# Altium project Baitap28.PrjPcb
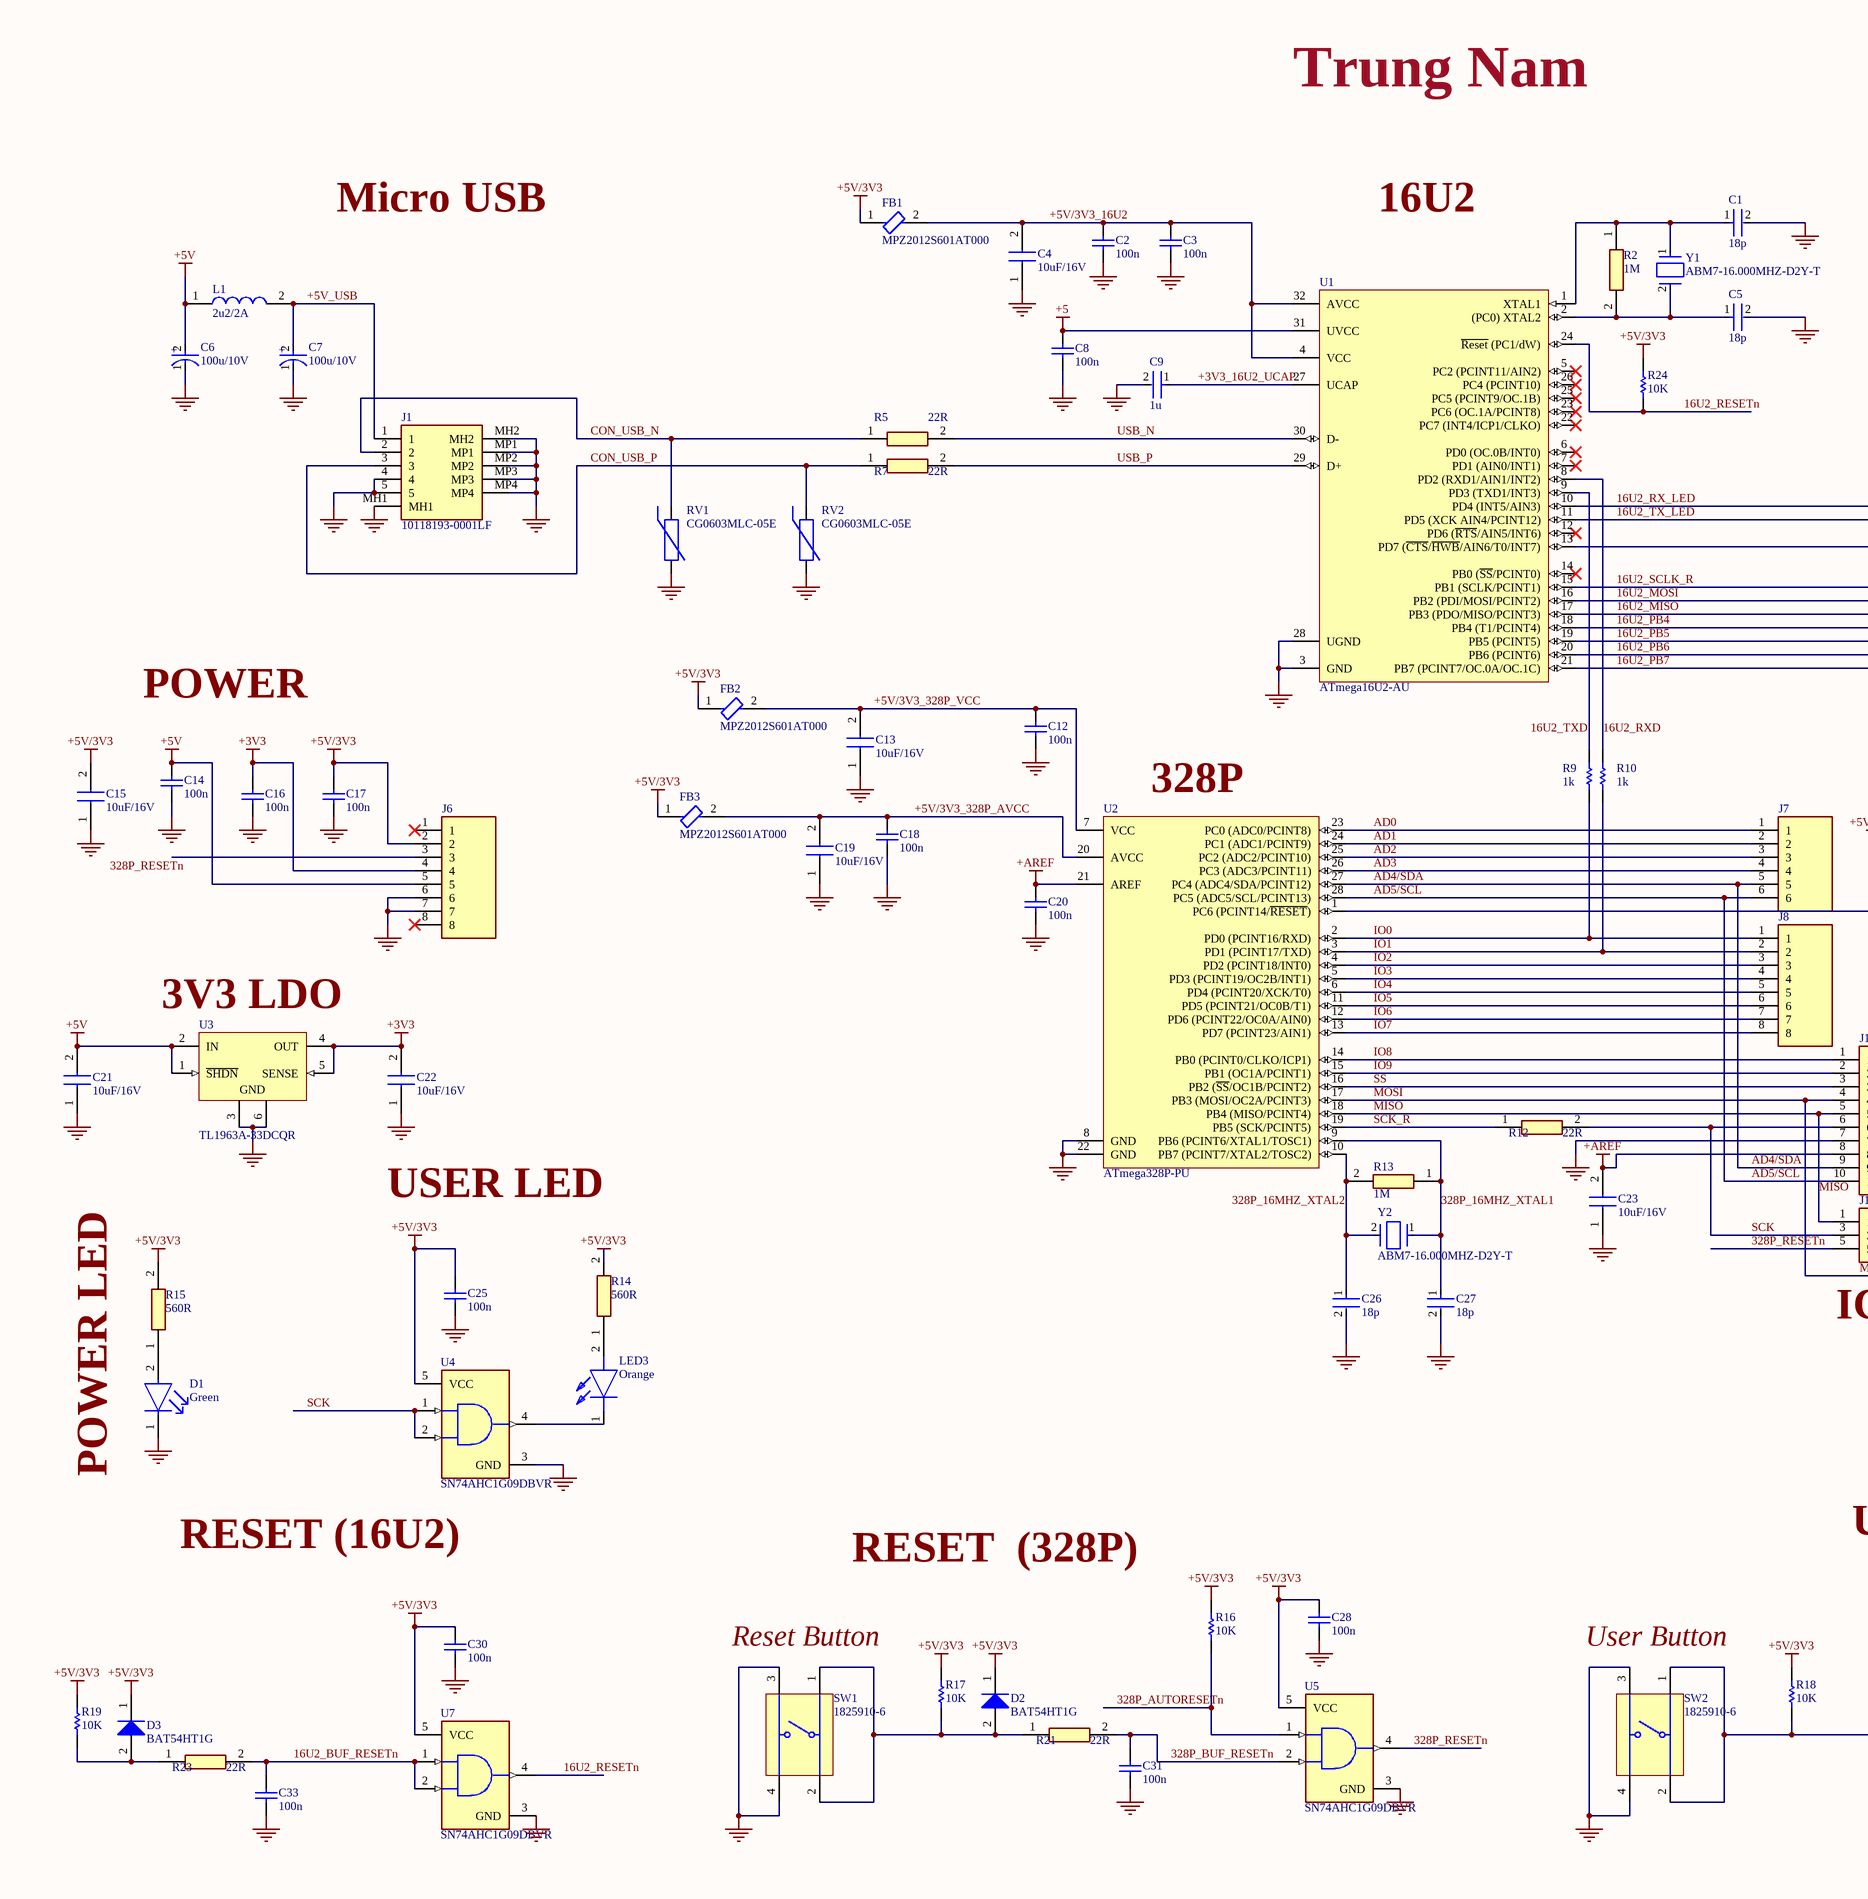
[diagram p0: schematic.SchDoc, left]
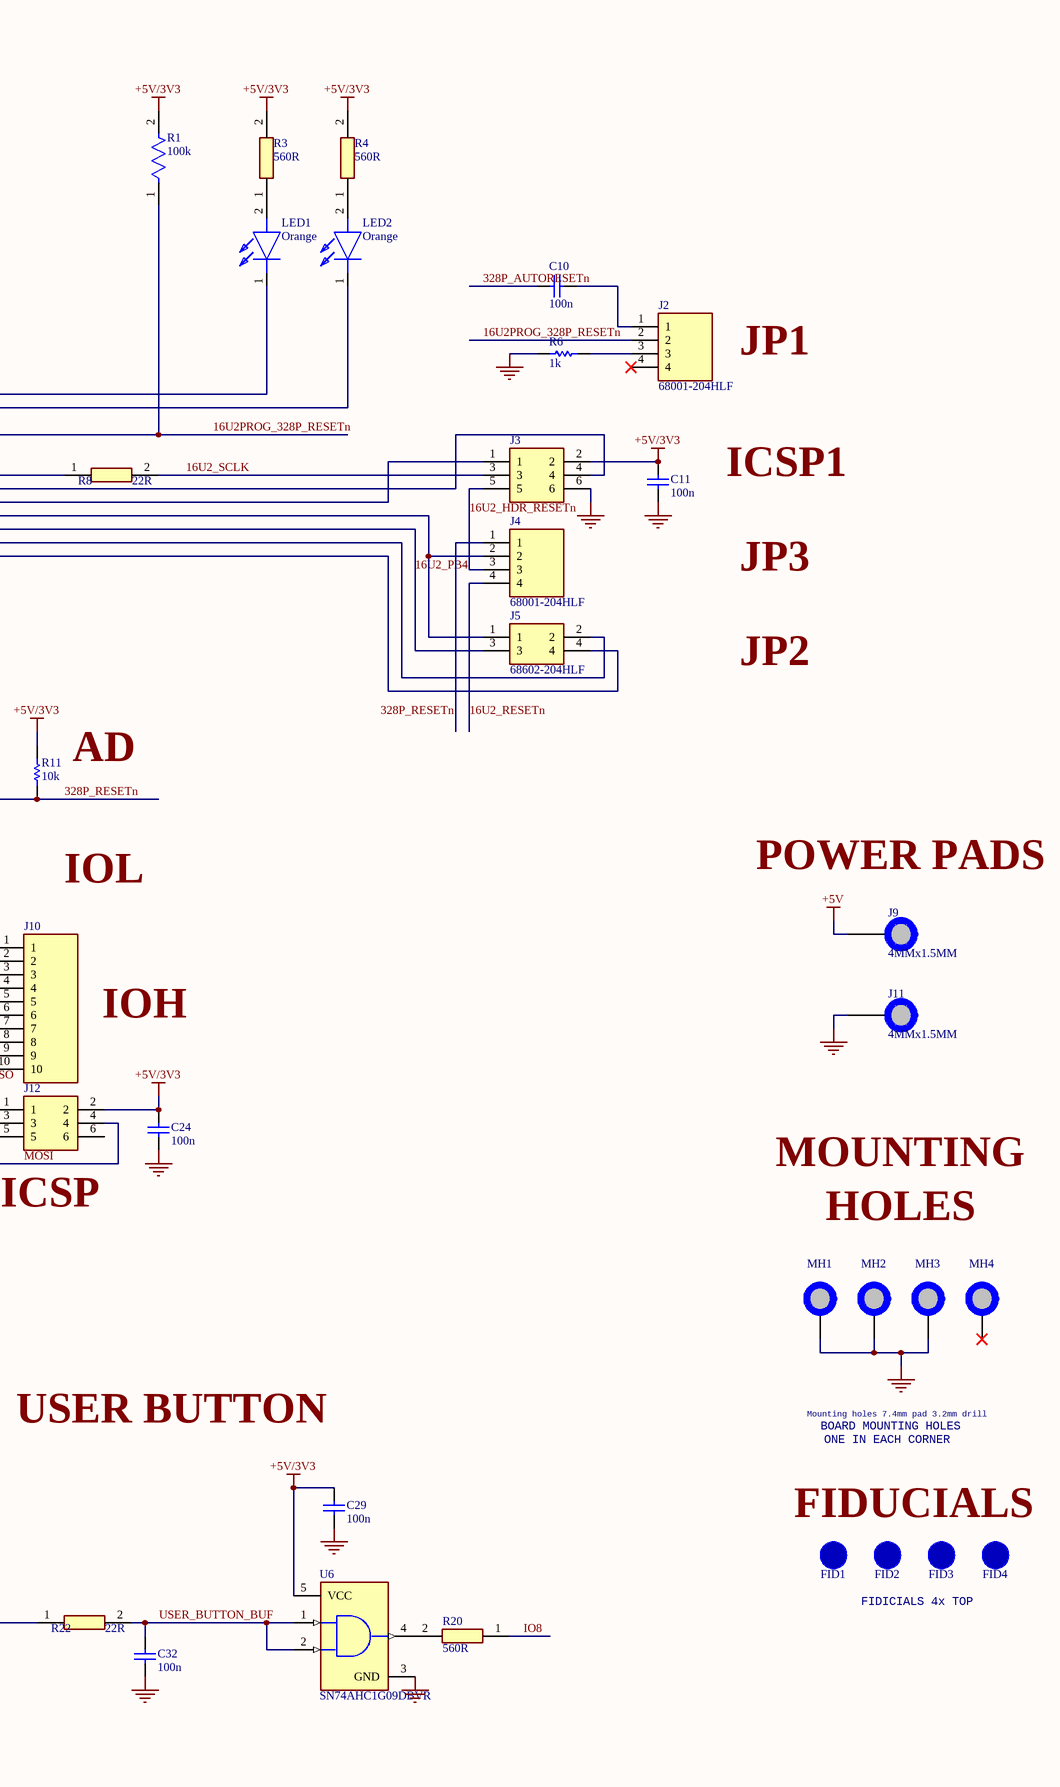
[diagram p1: schematic.SchDoc, right]
1 sheet, 100 parts. Net scope: global (net labels, ports and power ports of the same name join across sheets).
Board file: pcb.PcbDoc

## Sheet schematic.SchDoc
size A2; SheetNumber: 1; SheetTotal: 1

### Parts
C1  18p  [FP-C0805C-DN-MFG]
C2  100n  [CAPC2013X145X20LL20]
C3  100n  [CAPC2013X145X20LL20]
C4  10uF/16V  [CAPC2012X145N]
C5  18p  [FP-C0805C-DN-MFG]
C6  100u/10V  [FP-SC-MFG]
C7  100u/10V  [FP-SC-MFG]
C8  100n  [CAPC2013X145X20LL20]
C9  1u  [FP-C2012-125-0_2-IPC_A]
C10  100n  [CAPC2013X145X20LL20]
C11  100n  [CAPC2013X145X20LL20]
C12  100n  [CAPC2013X145X20LL20]
C13  10uF/16V  [CAPC2012X145N]
C14  100n  [CAPC2013X145X20LL20]
C15  10uF/16V  [CAPC2012X145N]
C16  100n  [CAPC2013X145X20LL20]
C17  100n  [CAPC2013X145X20LL20]
C18  100n  [CAPC2013X145X20LL20]
C19  10uF/16V  [CAPC2012X145N]
C20  100n  [CAPC2013X145X20LL20]
C21  10uF/16V  [CAPC2012X145N]
C22  10uF/16V  [CAPC2012X145N]
C23  10uF/16V  [CAPC2012X145N]
C24  100n  [CAPC2013X145X20LL20]
C25  100n  [CAPC2013X145X20LL20]
C26  18p  [FP-C0805C-DN-MFG]
C27  18p  [FP-C0805C-DN-MFG]
C28  100n  [CAPC2013X145X20LL20]
C29  100n  [CAPC2013X145X20LL20]
C30  100n  [CAPC2013X145X20LL20]
C31  100n  [CAPC2013X145X20LL20]
C32  100n  [CAPC2013X145X20LL20]
C33  100n  [CAPC2013X145X20LL20]
D1  Green  [FP-LG_L29K-MFG]
D2  BAT54HT1G  [ONSC-SOD-323-2-477-02_V]
D3  BAT54HT1G  [ONSC-SOD-323-2-477-02_V]
FB1  MPZ2012S601AT000  [FP-MPZ2012-MFG]
FB2  MPZ2012S601AT000  [FP-MPZ2012-MFG]
FB3  MPZ2012S601AT000  [FP-MPZ2012-MFG]
FID1  FID_1MMC  [FID_40X120D]  (value not drawn)  (no BOM)
FID2  FID_1MMC  [FID_40X120D]  (value not drawn)  (no BOM)
FID3  FID_1MMC  [FID_40X120D]  (value not drawn)  (no BOM)
FID4  FID_1MMC  [FID_40X120D]  (value not drawn)  (no BOM)
J1  10118193-0001LF  [101181930001LF]
J2  68001-204HLF  [HDRV4W67P0X254_1X4_1016X241X858P]
J3  A2541WV-2x3P-C808D808-G15  [HDRV6W64P254_2X3_762X508X533P]  (value not drawn)
J4  68001-204HLF  [HDRV4W67P0X254_1X4_1016X241X858P]
J5  68602-204HLF  [HDRV4W67P254_2X2_508X483X888P]
J6  M20-7820842  [RHDR8W80P0X254_1X8_2032X254X850P]  (value not drawn)
J7  M20-7820646  [HDRV6W70P0X254_1X6_1564X250X865P]  (value not drawn)
J8  M20-7820842  [RHDR8W80P0X254_1X8_2032X254X850P]  (value not drawn)
J9  4MMx1.5MM  [PAD_WITH_HOLE_4MMx1.5MM]  (no BOM)
J10  M20-7821046  [RHDR10W70P0X254_1X10_2580X250X865P]  (value not drawn)
J11  4MMx1.5MM  [PAD_WITH_HOLE_4MMx1.5MM]  (no BOM)
J12  A2541WV-2x3P-C808D808-G15  [HDRV6W64P254_2X3_762X508X533P]  (value not drawn)
L1  2u2/2A  [INDC3225X270N]
LED1  Orange  [SODFL1708X67N]
LED2  Orange  [SODFL1708X67N]
LED3  Orange  [SODFL1708X67N]
MH1  MH_7.4MMC_3.2MMD  [MH_7.4MMD_3.2MMD]  (value not drawn)  (no BOM)
MH2  MH_7.4MMC_3.2MMD  [MH_7.4MMD_3.2MMD]  (value not drawn)  (no BOM)
MH3  MH_7.4MMC_3.2MMD  [MH_7.4MMD_3.2MMD]  (value not drawn)  (no BOM)
MH4  MH_7.4MMNC_3.2MMD  [MH_7.4MMD_3.2MMD_NON_COPPER_NPTH]  (value not drawn)  (no BOM)
R1  100k  [FP-RC0805-0_6-IPC_C]
R2  1M  [RESC2012X60N]
R3  560R  [RESC2012X60N]
R4  560R  [RESC2012X60N]
R5  22R  [RESC2012X60N]
R6  1k  [RESC2013X60X35ML10T20]
R7  22R  [RESC2012X60N]
R8  22R  [RESC2012X60N]
R9  1k  [RESC2013X60X35ML10T20]
R10  1k  [RESC2013X60X35ML10T20]
R11  10k  [RESC2013X60X35NL10T20]
R12  22R  [RESC2012X60N]
R13  1M  [RESC2012X60N]
R14  560R  [RESC2012X60N]
R15  560R  [RESC2012X60N]
R16  10K  [RESC2013X60X35NL10T20]
R17  10K  [RESC2013X60X35NL10T20]
R18  10K  [RESC2013X60X35NL10T20]
R19  10K  [RESC2013X60X35NL10T20]
R20  560R  [RESC2012X60N]
R21  22R  [RESC2012X60N]
R22  22R  [RESC2012X60N]
R23  22R  [RESC2012X60N]
R24  10K  [RESC2013X60X35NL10T20]
RV1  CG0603MLC-05E  [BOUR-CG0603-2_V]
RV2  CG0603MLC-05E  [BOUR-CG0603-2_V]
SW1  1825910-6  [TECO-1825910-6_V]
SW2  1825910-6  [TECO-1825910-6_V]
U1  ATmega16U2-AU  [32A_M]
U2  ATmega328P-PU  [28P3]
U3  TL1963A-33DCQR  [DCQ0006A_L]
U4  SN74AHC1G09DBVR  [FP-DBV0005A-MFG]
U5  SN74AHC1G09DBVR  [FP-DBV0005A-MFG]
U6  SN74AHC1G09DBVR  [FP-DBV0005A-MFG]
U7  SN74AHC1G09DBVR  [FP-DBV0005A-MFG]
Y1  ABM7-16.000MHZ-D2Y-T  [FP-ABM7-MFG]
Y2  ABM7-16.000MHZ-D2Y-T  [FP-ABM7-MFG]

### Nets
+3V3: C16.2 C22.2 J6.4 U3.4(OUT) U3.5(SENSE)
+5: C8.2 U1.31(UVCC)
+5V: C6.2(A) C14.2 C21.2 J6.5 J9.1 L1.1 U3.1(~{SHDN}) U3.2(IN)
+5V/3V3: C11.2 C15.2 C17.2 C24.2 C25.2 C28.2 C29.2 C30.2 D2.1(K) D3.1(K) FB1.1 FB2.1 FB3.1 J3.2 J6.2 J12.2 R1.2 R3.2 R4.2 R11.2 R14.2 R15.2 R16.2 R17.2 R18.2 R19.2 R24.2 U4.5(VCC) U5.5(VCC) U6.5(VCC) U7.5(VCC)
+AREF: C20.2 C23.2 J10.8 U2.21(AREF)
GND: C1.2 C2.1 C3.1 C4.1 C5.2 C6.1(C) C7.1(C) C8.1 C9.2 C11.1 C12.1 C13.1 C14.1 C15.1 C16.1 C17.1 C18.1 C19.1 C20.1 C21.1 C22.1 C23.1 C24.1 C25.1 C26.2 C27.2 C28.1 C29.1 C30.1 C31.1 C32.1 C33.1 D1.1(C) J1.4 J1.5 J1.MH1 J1.MH2 J1.MP1 J1.MP2 J1.MP3 J1.MP4 J3.6 J6.6 J6.7 J10.7 J11.1 MH1.1 MH2.1 MH3.1 R6.2 RV1.2 RV2.2 SW1.3 SW1.4 SW2.3 SW2.4 U1.3(GND) U1.28(UGND) U2.8(GND) U2.22(GND) U3.3(GND) U3.6(GND) U4.3(GND) U5.3(GND) U6.3(GND) U7.3(GND)
16U2_BUF_RESETn: C33.2 R23.2 U7.1(A) U7.2(B)
16U2_HDR_RESETn: J3.5 J4.3
16U2_MISO: J3.1 U1.17(PB3_(PDO/MISO/PCINT3))
16U2_MOSI: J3.4 U1.16(PB2_(PDI/MOSI/PCINT2))
16U2_PB4: J4.2 J5.1 U1.18(PB4_(T1/PCINT4))
16U2_PB5: J5.3 U1.19(PB5_(PCINT5))
16U2_PB6: J5.2 U1.20(PB6_(PCINT6))
16U2_PB7: J5.4 U1.21(PB7_(PCINT7/OC.0A/OC.1C))
16U2_RESETn: J4.4 R24.1 U1.24(~{Reset}_(PC1/dW)) U7.4(Y)
16U2_RX_LED: LED1.1(K) U1.10(PD4_(INT5/AIN3))
16U2_RXD: R10.2 U1.8(PD2_(RXD1/AIN1/INT2))
16U2_SCLK: J3.3 R8.2
16U2_SCLK_R: R8.1 U1.15(PB1_(SCLK/PCINT1))
16U2_TX_LED: LED2.1(K) U1.11(PD5_(XCK_AIN4/PCINT12))
16U2_TXD: R9.2 U1.9(PD3_(TXD1/INT3))
16U2PROG_328P_RESETn: J2.2 R1.1 U1.13(PD7_(~{CTS}/~{HWB}/AIN6/T0/INT7))
328P_16MHZ_XTAL1: C27.1 R13.1 U2.9(PB6_(PCINT6/XTAL1/TOSC1)) Y2.1
328P_16MHZ_XTAL2: C26.1 R13.2 U2.10(PB7_(PCINT7/XTAL2/TOSC2)) Y2.2
328P_AUTORESETn: C10.2 R16.1 U5.1(A)
328P_BUF_RESETn: C31.2 R21.2 U5.2(B)
328P_RESETn: J4.1 J6.3 J12.5 R11.1 U2.1(PC6_(PCINT14/~{RESET})) U5.4(Y)
+3V3_16U2_UCAP: C9.1 U1.27(UCAP)
+5V/3V3_16U2: C2.2 C3.2 C4.2 FB1.2 U1.4(VCC) U1.32(AVCC)
+5V/3V3_328P_AVCC: C18.2 C19.2 FB3.2 U2.20(AVCC)
+5V/3V3_328P_VCC: C12.2 C13.2 FB2.2 U2.7(VCC)
+5V_USB: C7.2(A) J1.1 L1.2
AD0: J7.1 U2.23(PC0_(ADC0/PCINT8))
AD1: J7.2 U2.24(PC1_(ADC1/PCINT9))
AD2: J7.3 U2.25(PC2_(ADC2/PCINT10))
AD3: J7.4 U2.26(PC3_(ADC3/PCINT11))
AD4/SDA: J7.5 J10.9 U2.27(PC4_(ADC4/SDA/PCINT12))
AD5/SCL: J7.6 J10.10 U2.28(PC5_(ADC5/SCL/PCINT13))
CON_USB_N: J1.2 R5.1 RV1.1
CON_USB_P: J1.3 R7.1 RV2.1
IO0: J8.1 R9.1 U2.2(PD0_(PCINT16/RXD))
IO1: J8.2 R10.1 U2.3(PD1_(PCINT17/TXD))
IO2: J8.3 U2.4(PD2_(PCINT18/INT0))
IO3: J8.4 U2.5(PD3_(PCINT19/OC2B/INT1))
IO4: J8.5 U2.6(PD4_(PCINT20/XCK/T0))
IO5: J8.6 U2.11(PD5_(PCINT21/OC0B/T1))
IO6: J8.7 U2.12(PD6_(PCINT22/OC0A/AIN0))
IO7: J8.8 U2.13(PD7_(PCINT23/AIN1))
IO8: J10.1 R20.1 U2.14(PB0_(PCINT0/CLKO/ICP1))
IO9: J10.2 U2.15(PB1_(OC1A/PCINT1))
MISO: J10.5 J12.1 U2.18(PB4_(MISO/PCINT4))
MOSI: J10.4 J12.4 U2.17(PB3_(MOSI/OC2A/PCINT3))
SCK: J10.6 J12.3 R12.2 U4.1(A) U4.2(B)
SCK_R: R12.1 U2.19(PB5_(SCK/PCINT5))
SS: J10.3 U2.16(PB2_(~{SS}/OC1B/PCINT2))
USB_N: R5.2 U1.30(D-)
USB_P: R7.2 U1.29(D+)
USER_BUTTON_BUF: C32.2 R22.2 U6.1(A) U6.2(B)
NetC1_1: C1.1 R2.1 U1.1(XTAL1) Y1.1
NetC5_1: C5.1 R2.2 U1.2((PC0)_XTAL2) Y1.2
NetC10_1: C10.1 J2.1
NetD1_2: D1.2(A) R15.1
NetD2_2: D2.2(A) R17.1 R21.1 SW1.1 SW1.2
NetD3_2: D3.2(A) R19.1 R23.1
NetJ2_3: J2.3 R6.1
NetLED1_2: LED1.2(A) R3.1
NetLED2_2: LED2.2(A) R4.1
NetLED3_1: LED3.1(K) U4.4(Y)
NetLED3_2: LED3.2(A) R14.1
NetR18_1: R18.1 R22.1 SW2.1 SW2.2
NetR20_2: R20.2 U6.4(Y)

Not connected (* = marked no-connect by the designer): J2 4*; J6 1* 8*; J12 6; MH4 1*; U1 5(PC2_(PCINT11/AIN2))* 6(PD0_(OC.0B/INT0))* 7(PD1_(AIN0/INT1))* 12(PD6_(~{RTS}/AIN5/INT6))* 14(PB0_(~{SS}/PCINT0))* 22(PC7_(INT4/ICP1/CLKO))* 23(PC6_(OC.1A/PCINT8))* 25(PC5_(PCINT9/OC.1B))* 26(PC4_(PCINT10))*

### Notes on the sheet
- Trung Nam
- Micro USB
- 16U2
- JP1
- ICSP1
- JP3
- POWER
- (near U2) 328P
- JP2
- (near R11) AD
- IOL
- POWER PADS
- (near U3) 3V3 LDO
- IOH
- USER LED
- POWER LED
- (near J12) ICSP
- MOUNTING
- HOLES
- USER BUTTON
- Mounting holes 7.4mm pad 3.2mm drill
- BOARD MOUNTING HOLES
- (near U4) RESET (16U2)
- RESET  (328P)
- ONE IN EACH CORNER
- Reset Button
- User Button
- FIDUCIALS
- FIDICIALS 4x TOP
- (in symbol CMP-05427-000047-1) +

### Library data of the parts
C1 C5 C26 C27 = CMP-2007-00302-2: CAP CER 18PF 50V C0G/NP0 0805; Manufacturer: KEMET; Manufacturer Part Number: C0805C180J5GACTU; Temperature Characteristic: C0G; Tolerance: 0.05; Material: Ceramic; Temperature Coefficient: 30ppm/°C; Device Class L2: Capacitors; Capacitance: 18 pF; Temperature: -55°C to +125°C; Value: 18 pF; Package: C0805C-DN; Mouser Description: Cap Ceramic 18pF 50V C0G 5% SMD 0805 125C Paper T/R; Height: 0.88mm; ComponentLink2URL: https://content.kemet.com/datasheets/KEM_C1003_C0G_SMD.pdf; RoHS: TRUE; Octopart: https://octopart.com/c0805c180j5gactu-kemet-144810; ComponentLink2Description: Datasheet; Temperature Range High: +125°C; Digikey Description: CAP CER 18PF 50V C0G/NP0 0805; Device Class L1: Passive Components; Category: Cap; Automotive: No; Device Class L3: Ceramic Capacitors; Voltage Rating: 50 V; Temperature Range Low: -55°C; Ipc Land Pattern Name: CAPC200125X78; Lead Free: Yes
C2 C3 C8 C10-C12 C14 C16-C18 C20 C24 C25 C28-C33 = CMP-2000-07557-1: Chip Capacitor, 0.1 uF, +/- 10%, 50 V, -55 to 125 degC, 0805 (2012 Metric), RoHS, Tape and Reel; Manufacturer: TDK; Voltage Rating: 50V; Dielectric Material: Ceramic; Capacitance: 100nF; Dielectric: X7R; Datasheet Version: 07/2017; Max Operating Temperature: 125degC; RoHSCompliant: True; Min Operating Temperature: -55degC; Case/Package: 0805; Composition: Ceramic; Width: 0.049inch; Thickness: 0.037inch; Datasheet URL: https://product.tdk.com/info/en/catalog/datasheets/mlcc_commercial_general_en.pdf; Height: 0.85mm; Voltage Rating (DC): 50V; Voltage: 50V; Packaging: TapeandReel; Mounting Technology: SurfaceMount; Case Code (Metric): 2012; Length: 2mm; Radiation Hardening: No; Number of Pins: 2; REACH SVHC: NoSVHC; Lead Free: LeadFree; Package Reference: 805; Weight: 0.000194oz; Tolerance: 10%; Package Description: 2-Pin Surface Mount Device, Body 2 x 1.25 mm; Manufacturer URL: http://www.tdk.com/; Package Quantity: 1; Case Code (Imperial): 0805; Mount: SurfaceMount; Depth: 1.25mm; Termination: SMD/SMT
C4 C13 C15 C19 C21-C23 = C2012X5R1C106M125AC: Capacitor; Manufacturer_Name: TDK; Datasheet Link: https://product.tdk.com/info/en/catalog/datasheets/mlcc_commercial_midvoltage_en.pdf; Height: 1.45mm; Manufacturer_Part_Number: C2012X5R1C106M125AC; Mouser Part Number: 810-C2012X5R1C106M-3; Mouser Price/Stock: https://www.mouser.co.uk/ProductDetail/TDK/C2012X5R1C106M125AC?qs=LcTL%2F5vFEzHcq9TBdtOIgw%3D%3D
C6 C7 = CMP-05427-000047-1: CAP ALUM 100UF 20% 10V SMD; Life (Hours): 1000Hour; Ripple Current: 50mA; Packaging: Tape and Reel; Diameter: 5mm; Voltage Rating (DC): 10V; Mount: Surface Mount; Max Operating Temperature: 85°C; Length: 5.5mm; Case/Package: Radial; Height: 5.4mm; Construction: Cylindrical; Termination: SMD/SMT; Height - Seated (Max): 0.213inch; Series: S; Min Operating Temperature: -40°C; Capacitance: 100uF; Tolerance: 20%; Voltage Rating: 10V; Package Quantity: 1; Radiation Hardening: No; Ripple Current (AC): 50mA; Lead Free: Lead Free; RoHS Compliant: Yes; Contact Plating: Tin
C9 = CMP-08246-005389-1: Multilayer Ceramic Capacitors 1μF ±10% 25V X5R SMD 0805; Capacitance: 1uF; Min Operating Temperature: -55°C; Construction: Flat; Package Quantity: 2000; Height: 1.25mm; Resistor Type: Ceramic; Case/Package: 0805; Depth: 1.25mm; Case Code (Metric): 2012; Weight: 0.000194oz; REACH SVHC: No SVHC; Dielectric: X5R; Max Operating Temperature: 85°C; Number of Pins: 2; Thickness: 0.057inch; RoHS Compliant: Yes; Radiation Hardening: No; Lead Free: Lead Free; Case Code (Imperial): 0805; Length: 2mm; Voltage Rating: 25V; Mount: Surface Mount; Voltage Rating (DC): 25V; Packaging: Tape and Reel; Dielectric Material: Ceramic; Termination: SMD/SMT; Voltage: 25V; Tolerance: 10%; Series: C; Width: 0.049inch
D1 = CMP-62016-000024-1: LED GREEN DIFFUSED 0603 SMD; Number of LEDs: 1; Forward Current: 20mA; Luminous Intensity: 5.6mcd; Luminous Flux: 0.012lm; Dominant Wavelength: 570nm; Lens Style: Flat; Forward Voltage: 2.2V; Reverse Voltage: 12V; Viewing Angle: 160°; Lens Size: 0.8mm; Test Current: 2mA; Lens Color: White; Length: 1.3mm; Radiation Hardening: No; Color: Green; Number of Pins: 2; Depth: 0.8mm; Number of Elements: 1; Case Code (Metric): 1608; Case Code (Imperial): 0603; Illumination Color: Green; Width: 0.8mm; Lens Transparency: Diffused; Mount: Surface Mount; Min Operating Temperature: -40°C; Packaging: Tape and Reel; Max Operating Temperature: 100°C; Case/Package: 0603; Height: 0.65mm; Package Quantity: 5000
D2 D3 = CMP-1055-00462-1: Schottky Barrier Diode, 2-Pin SOD-323, Pb-Free, Tape and Reel; Manufacturer: On Semiconductor; Configuration: Single; trr Max (ns): 5; IFSM Max (A): 0.6; ComponentLink3URL: http://www.onsemi.com/pub_link/Collateral/477-02.PDF.1; PackageDescription: 2-Pin SOD, Body 1.7 x 1.25 mm; ComponentLink2URL: http://www.onsemi.cn/pub_link/Collateral/BAT54HT1-D.PDF; ComponentLink3Description: Package Specification; ComponentLink2Description: Datasheet; DatasheetVersion: Rev. 6; PackageReference: SOD-323-2-477-02; RoHS: TRUE; ComponentLink1URL: http://www.onsemi.com/; Packing: Tape and Reel; PartNumber: BAT54HT1G; Mounting Technology: Surface Mount; ComponentLink1Description: Manufacturer URL; PackageVersion: Rev. H, 03/2007
FB1-FB3 = CMP-2000-05401-2: Manufacturer Lifecycle Status: PRODUCTION; NexarPartId: 12090955; RMS Current (Irms): 2A; Test Frequency: 100MHz; Tolerance: 25%; Core Material: Ferrite; Series Resistance: 100mΩ; Impedance: 600Ω; Packaging: Digi-Reel®; Length: 2mm; Min Operating Temperature: -55°C; Width: 1.25mm; Max Width: 1.45mm; Lead Free: Lead Free; Current Rating: 2A; Case Code (Imperial): 0805; Min Length: 1.8mm; Schedule B: 8504500000, 8504500000; REACH SVHC: No SVHC; Case Code (Metric): 2012; Max DC Current: 2A; Case/Package: 0805; Lifecycle Status: Production; Min Width: 1.05mm; Mount: Surface Mount; Height: 1.0414mm; Resistance: 100mΩ; DC Resistance (DCR): 100mΩ; Max Operating Temperature: 125°C; Max Length: 2.2mm; RoHS: Compliant
FID1-FID4 = FID_1MMC: Fiducial 40mil Diameter, 120mil Mask; Supplier: Digikey
J1 = 10118193-0001LF: Connector; Manufacturer_Name: Amphenol Communications Solutions; Datasheet Link: https://cdn.amphenol-cs.com/media/wysiwyg/files/drawing/10118193.pdf; Height: 3.3mm; Manufacturer_Part_Number: 10118193-0001LF; Arrow Part Number: 10118193-0001LF; Arrow Price/Stock: https://www.arrow.com/en/products/10118193-0001lf/amphenol-fci?utm_currency=USD&region=europe
J2 J4 = 68001-204HLF: Connector; Manufacturer_Name: Amphenol Communications Solutions; Datasheet Link: https://cdn.amphenol-cs.com/media/wysiwyg/files/drawing/68000.pdf; Height: 8.58mm; Manufacturer_Part_Number: 68001-204HLF
J3 J12 = A2541WV-2x3P-C808D808-G15: Connector; Manufacturer_Name: Changjiang Connectors; Datasheet Link: https://www.cjt.com/Upload/A2541.pdf; Height: 5.33mm; Manufacturer_Part_Number: A2541WV-2x3P-C808D808-G15
J5 = 68602-204HLF: Connector; Manufacturer_Name: Amphenol; Datasheet Link: https://cdn.amphenol-icc.com/media/wysiwyg/files/drawing/67996.pdf; Height: 8.88mm; Manufacturer_Part_Number: 68602-204HLF; Mouser Part Number: 649-68602-204HLF; Mouser Price/Stock: https://www.mouser.co.uk/ProductDetail/Amphenol-FCI/68602-204HLF?qs=CEgdKq8q45VwVPnJk6o7tQ%3D%3D; Arrow Part Number: 68602-204HLF; Arrow Price/Stock: https://www.arrow.com/en/products/68602-204hlf/amphenol-fci?region=nac
J6 J8 = M20-7820842: Connector; Manufacturer_Name: Harwin; Datasheet Link: https://cdn.harwin.com/pdfs/M20-782.pdf; Height: 8.5mm; Manufacturer_Part_Number: M20-7820842; Mouser Part Number: 855-M20-7820842; Mouser Price/Stock: https://www.mouser.co.uk/ProductDetail/Harwin/M20-7820842?qs=WS5Jv%252B%252Bx1qXOep0XOTvy2Q%3D%3D
J7 = M20-7820646: Connector; Manufacturer_Name: Harwin; Datasheet Link: https://cdn.harwin.com/pdfs/M20-782.pdf; Height: 8.65mm; Manufacturer_Part_Number: M20-7820646; Mouser Part Number: 855-M20-7820646; Mouser Price/Stock: https://www.mouser.co.uk/ProductDetail/Harwin/M20-7820646?qs=WS5Jv%252B%252Bx1qWZs4rbTjPGWw%3D%3D
J9 J11 = PAD_WITH_HOLE_4MMx1.5MM: Pad with a hole 4mm x 1.5mm
J10 = M20-7821046: Connector; Manufacturer_Name: Harwin; Datasheet Link: https://cdn.harwin.com/pdfs/M20-782.pdf; Height: 8.65mm; Manufacturer_Part_Number: M20-7821046; Mouser Part Number: 855-M20-7821046; Mouser Price/Stock: https://www.mouser.co.uk/ProductDetail/Harwin/M20-7821046?qs=Jph8NoUxIfXTsFl0wvOA6g%3D%3D
L1 = L1210R2R2MDWIT: Inductor; Manufacturer_Name: KEMET; Datasheet Link: https://content.kemet.com/datasheets/KEM_L9015_L-DWI.pdf; Height: 2.7mm; Manufacturer_Part_Number: L1210R2R2MDWIT; Mouser Part Number: 80-L1210R2R2MDWIT; Mouser Price/Stock: https://www.mouser.co.uk/ProductDetail/KEMET/L1210R2R2MDWIT?qs=v1sh8PPj49i7zaK1i33Fzg%3D%3D; Arrow Part Number: L1210R2R2MDWIT; Arrow Price/Stock: https://www.arrow.com/en/products/l1210r2r2mdwit/kemet-corporation?region=nac
LED1-LED3 = LO_L29K-H2K1-24-Z: LED; Manufacturer_Name: ams OSRAM; Manufacturer_Part_Number: LO L29K-H2K1-24-Z; Datasheet Link: https://datasheet.datasheetarchive.com/originals/distributors/DKDS41/DSANUWW0036666.pdf; Height: 0.67mm; Mouser Part Number: 720-LOL29KH2K124Z; Mouser Price/Stock: https://www.mouser.com/Search/Refine.aspx?Keyword=720-LOL29KH2K124Z; Arrow Part Number: LO L29K-H2K1-24-Z; Arrow Price/Stock: https://www.arrow.com/en/products/lol29k-h2k1-24-z/osram-opto-semiconductors
MH1-MH3 = MH_7.4MMC_3.2MMD: Mounting Hole 7.4mm Diameter, 3.2mm Drill; .Creator: MM
MH4 = MH_7.4MMNC_3.2MMD: Mounting Hole 7.4mm Diameter (Non Copper), 3.2mm Drill NPTH
R1 = CMP-2100-03668-5: RES 100K OHM 1% 1/8W 0805; Power Rating: 125mW; Temperature Coefficient: 100ppm/°C; Voltage Rating (DC): 150V; Resistance: 100kR; Package Quantity: 1; Case/Package: 0805; Lead Pitch: 0.4mm; Case Code (Imperial): 0805; Construction: Rectangular; Number of Terminations: 2; RoHS Compliant: Yes; Max Power Dissipation: 125mW; Tolerance: 1%; Max Operating Temperature: 155°C; Resistance Tolerance: 1%; Lead Free: Lead Free; Packaging: Tape and Reel; Resistor Type: Thick Film; Min Operating Temperature: -55°C; Case Code (Metric): 2012; Series: RC; Technology: THICK FILM; Voltage Rating: 150V; Termination: SMD/SMT; Width: 0.049inch; Number of Pins: 2; Features: Moisture Resistant; Military Standard: Not; Length: 0.079inch; Depth: 1.25mm; Size Code: 0805; Height: 0.024inch
R2 R13 = RC0805FR-071ML: Resistor; Manufacturer_Name: KEMET; Datasheet Link: http://www.yageo.com/documents/recent/PYu-RC_Group_51_RoHS_L_10.pdf; Height: 0.6mm; Manufacturer_Part_Number: RC0805FR-071ML; Mouser Part Number: 603-RC0805FR-071ML; Mouser Price/Stock: https://www.mouser.co.uk/ProductDetail/YAGEO/RC0805FR-071ML?qs=8Y8p%252BasKcI6wvSL4jxV1pQ%3D%3D; Arrow Part Number: RC0805FR-071ML; Arrow Price/Stock: https://www.arrow.com/en/products/rc0805fr-071ml/yageo?region=europe
R3 R4 R14 R15 R20 = RC0805FR-07560RL: Resistor; Manufacturer_Name: KEMET; Datasheet Link: http://www.yageo.com/documents/recent/PYu-RC_Group_51_RoHS_L_10.pdf; Height: 0.6mm; Manufacturer_Part_Number: RC0805FR-07560RL; Mouser Part Number: 603-RC0805FR-07560RL; Mouser Price/Stock: https://www.mouser.co.uk/ProductDetail/YAGEO/RC0805FR-07560RL?qs=g6xwsc4j%252B%2Foqaguphwrcog%3D%3D; Arrow Part Number: RC0805FR-07560RL; Arrow Price/Stock: https://www.arrow.com/en/products/rc0805fr-07560rl/yageo?region=nac
R5 R7 R8 R12 R21-R23 = RC0805FR-0722RL: Resistor; Manufacturer_Name: KEMET; Datasheet Link: http://www.yageo.com/documents/recent/PYu-RC_Group_51_RoHS_L_10.pdf; Height: 0.6mm; Manufacturer_Part_Number: RC0805FR-0722RL; Mouser Part Number: 603-RC0805FR-0722RL; Mouser Price/Stock: https://www.mouser.com/Search/Refine.aspx?Keyword=603-RC0805FR-0722RL; Arrow Part Number: RC0805FR-0722RL; Arrow Price/Stock: https://www.arrow.com/en/products/rc0805fr-0722rl/yageo
R6 R9 R10 = CMP-2100-03671-1: Chip Resistor, 1 KOhm, +/- 1%, 125 mW, -55 to 155 degC, 0805 (2012 Metric), RoHS, Tape and Reel; Manufacturer: Yageo; Temperature Coefficient: 100ppm/degreesC; Voltage Rating (DC): 150V; Max Power Dissipation: 125mW; Resistance: 1KOhm; Number of Pins: 2; Number of Terminations: 2; Datasheet URL: http://www.yageo.com/NewPortal/yageodocoutput?fileName=/pdf/R-Chip/PYu-RC_Group_51_RoHS_L_5.pdf; Length: 0.079inch; Package Description: 2-Pin Surface Mounted Device, Body 2 x 1.25 mm; Depth: 1.25mm; Height: 0.024inch; Military Standard: Not; Case/Package: 0805; Package Reference: 0805; RoHSCompliant: true; Lead Free: LeadFree; Packaging: TapeandReel; Package Quantity: 1; Datasheet Version: Rev. 5, 10/2016; Tolerance: 1%; Min Operating Temperature: -55degC; Voltage Rating: 150V; Composition: ThickFilm; Case Code (Imperial): 0805; Power Rating: 125mW; Width: 0.049inch; Case Code (Metric): 2012; Manufacturer URL: http://www.yageo.com/; Max Operating Temperature: 155degC; REACH SVHC: Unknown; Termination: SMD/SMT
R11 R16-R19 R24 = CMP-1659-00013-4: Chip Resistor, 10 KOhm, +/- 1%, 0.125 W, -55 to 155 degC, 0805 (2012 Metric), RoHS, Tape and Reel; Manufacturer: Yageo; Voltage Rating: 150 V; Mount: Surface Mount; ComponentLink1Description: Manufacturer URL; ComponentLink2URL: http://www.yageo.com/documents/recent/PYu-RC_Group_51_RoHS_L_04.pdf; Pins: 2; Length: 2 mm; Min Operating Temperature: -55 degC; Height: 0.5 mm; Mounting Technology: Surface Mount; RoHSCompliant: true; REACH SVHC: No SVHC; ComponentLink1URL: http://www.yageo.com/; Max Operating Temperature: 155 degC; PackageReference: 0805; DatasheetVersion: Rev. 4, 02/2016; Package Quantity: 5000; Packaging: Tape and Reel; ComponentLink2Description: Datasheet; PackageDescription: 2-Pin Surface Mounted Device, Body 2 x 1.25 mm
RV1 RV2 = CMP-0584-00001-2: ESD Protector, 5 V Supply, -40 to 85 degC, 1.6 x 0.8 x 0.55 mm SMD, RoHS, Tape and Reel; Manufacturer: Bourns; VC: 20 V; VT: 150 V; RT: 1 ns; VDC: 5 V; CO: 0.5 pF; PartNumber: CG0603MLC-05E; ComponentLink1Description: Manufacturer URL; ComponentLink1URL: http://www.bourns.com/; Packing: Tape and Reel; Mounting Technology: Surface Mount; ComponentLink2Description: Datasheet; RoHS: TRUE; Operating Temperature: -40 to 85 degC; DatasheetVersion: Rev. S; PackageDescription: 2-Pin SMD, Body 1.6 x 0.8 mm, Pitch 1.52 mm; PackageReference: CG0603-2; ComponentLink2URL: http://www.bourns.com/data/global/pdfs/MLC.pdf
SW1 SW2 = CMP-1684-00021-1: Tact Switch, SPST-NO, 0.05 A, -35 to 85 degC, 4-Pin THD, RoHS, Bulk; Manufacturer: TE Connectivity; Maximum Contact Resistance: 100mOhm; Mechanical Life: 100000Cycles; Bushing Type: Unthreaded; Switch Configuration: OFF(ON); Maximum DC Voltage Rating: 24V; Contact Rating @ Voltage: 0.05A@24VDC; Actuator Color: Black; Body Orientation: Straight; Function: MomentaryContact; Illumination: N/R; Actuator Style: RoundButton; Actuator Material: PolybutyleneTerephthalate; Dielectric Strength: 500VAC; Pole Throw Configuration: SPST; Actuator Length: 1.4mm; Product Weight: N/A; Contact Material: CopperAlloy; Housing Material: N/A; Terminal Type: PCPins; Minimum Insulation Resistance: 100MOhm; Package Description: 4-Pin Through Hole Device, Body 5.99 x 5.99 mm, Pitch 6.5 mm; Part No: 1825910-6; Package Reference: THD; Base Material: N/A; Manufacturer URL: http://www.te.com; Contact Plating: Silver; RoHS: Yes; Datasheet Version: Rev. C9; Electrical Life: 100000Cycles; Maximum AC Voltage Rating: N/A; Thread Size: N/R; Operating Temperature: -35to85C; Mounting: ThroughHole; Dimension: 5.99x5mm; Datasheet URL: http://www.te.com/commerce/DocumentDelivery/DDEController?Action=showdoc&DocId=Customer+Drawing%7F1825910%7FC9%7Fpdf%7FEnglish%7FENG_CD_1825910_C9.pdf%7F1825910-6; Family: 1825910; Seal Location: N/A; Seal Description: N/A; Packaging: N/A
U1 = CMP-0095-00303-3: 8-bit AVR Microcontroller, 2.7-5.5V, 16KB Flash, 512 Bytes EEPROM, 512 Bytes SRAM, 32-pin TQFP, Industrial Grade (-40°C to 85°C); RevisionNote: Schematic symbol corrected; PartNumber: ATmega16U2-AU; ComponentLink1URL: http://www.atmel.com/; ComponentLink2Description: ATmega8U2/16U2/32U2 Datasheet; PackageDescription: 32-Lead, 7x7x1.0 mm Body, 0.8mm Lead Pitch, Thin Profile Plastic Quad Flat Package (TQFP); Code_JEDEC: MS-026-ABA; DatasheetVersion: revD, Nov-2010; ComponentLink2URL: http://www.atmel.com/dyn/resources/prod_documents/doc7799.pdf; ComponentLink3URL: http://www.atmel.com/dyn/resources/prod_documents/7799S.pdf; ComponentLink3Description: ATmega8U2/16U2/32U2 Summary; PackageReference: 32A; PackageVersion: revC, Oct-2010; ComponentLink1Description: Manufacturer URL
U2 = CMP-0095-00013-2: 8-bit AVR Microcontroller, 32KB Flash, 1KB EEPROM, 2KB SRAM, 28-pin PDIP, Industrial Grade (-40°C to 85°C); RevisionNote: DatasheetVersion updated. URLs added.; PackageVersion: revB, Sep-2001; PackageDescription: 28-lead (0.300"/7.62mm Wide) Plastic Dual Inline Package (PDIP); DatasheetVersion: revD, May-2011; ComponentLink1Description: Manufacturer URL; ComponentLink1URL: http://www.atmel.com/; PackageReference: 28P3; ComponentLink2Description: ATmega48A/48PA/88A/88PA/168A/168PA/328/328P Datasheet; ComponentLink3URL: http://www.atmel.com/dyn/resources/prod_documents/8271S.pdf; ComponentLink2URL: http://www.atmel.com/dyn/resources/prod_documents/8271.pdf; ComponentLink3Description: ATmega48A/48PA/88A/88PA/168A/168PA/328/328P Summary
U3 = CMP-0395-00346-2: Single Output Low Noise LDO, 1.5 A, Fixed 3.3 V Output, 2.1 to 20 V Input, 6-pin SOT-223 (DCQ), -40 to 125 degC, Green (RoHS & no Sb/Br); Manufacturer: Texas Instruments; Iq(Typ)(mA): 1; Fixed Output Options(V): 3.3; Iout(Max)(A): 1.5; Vin(Min)(V): 2.1; SubFamily: Single Channel LDO; Vin(Max)(V): 20; Vdo(Typ)(mV): 340; Accuracy(%): 3; PackageDescription: 6-Pin Plastic Small Outline, Body 3.5 x 6.5 mm, Pitch 1.27 mm; ComponentLink3URL: http://www.ti.com/litv/pdf/mpds098c; DatasheetVersion: SLVS719F; Eco-Plan: Green (RoHS & no Sb/Br); ComponentLink1Description: Manufacturer URL; ComponentLink2URL: http://www.ti.com/general/docs/lit/getliterature.tsp?genericPartNumber=TL1963A-33&fileType=pdf; ComponentLink1URL: http://www.ti.com/; ComponentLink2Description: Datasheet; PackageVersion: 4202109/D; Mounting Technology: Surface Mount; Vout Adj(Min)(V): 3.3; ComponentLink3Description: Package Specification; Vout Adj(Max)(V): 3.3; PackageReference: DCQ0006A; PartNumber: TL1963A-33DCQR
U4-U7 = CMP-0859-00040-4: IC GATE AND 1CH 2-INP SOT23-5; Manufacturer: Texas Instruments; Number Of Outputs: 1; Standoff Height: 0mm; Max Supply Voltage: 5.5V; Nominal Supply Current: 1uA; Min Supply Voltage: 2V; Max Junction Temp: +150°C; Propagation Delay: 4.6ns; Number Of Inputs: 2; ComponentLink2Description: Datasheet; Temperature: -55°C to +125°C; Ambient Temperature Range High: +125°C; Logic Function Desc: AND; Device Class L1: Integrated Circuits (ICs); Height: 1.45mm; Device Class L3: Logic Gates; ComponentLink2URL: http://www.ti.com/lit/ds/symlink/sn74ahc1g09.pdf; Ambient Temperature Range Low: -55°C; RoHS: TRUE; Mouser Description: IC GATE AND 1CH 2-INP SOT-23-5; Temperature Range Low: -55°C; Digikey Description: IC GATE AND 1CH 2-INP SOT23-5; Ipc Land Pattern Name: SOT95P280X145-5; Octopart: https://octopart.com/sn74ahc1g09dbvr-texas+instruments-20351419; Device Class L2: Logic ICs; Manufacturer Part Number: SN74AHC1G09DBVR; Category: IC; Package: DBV0005A; Automotive: No; Lead Free: Yes; Number Of Circuits: 1; Temperature Range High: +125°C
Y1 Y2 = CMP-27762-000095-1: Crystal 16MHz ±20ppm 18pF SMD-2 6mm x 3.5mm; ESR (Equivalent Series Resistance): 50R; Frequency Stability: 30ppm; Width: 3.3mm; Frequency: 16MHz; Radiation Hardening: No; Height: 0.055inch; Tolerance: 20ppm; Length: 6mm; Case/Package: CSMD; Lead Free: Lead Free; Min Operating Temperature: -40°C; Termination: SMD/SMT; Operating Frequency: 16 MHz; Resistor Type: Ceramic; Packaging: Tape and Reel; Mount: Surface Mount; Load Capacitance: 18pF; Frequency Tolerance: 20ppm; Depth: 3.5mm; Series: ABM7; Package Quantity: 1000; Max Operating Temperature: 85°C; Number of Pins: 2